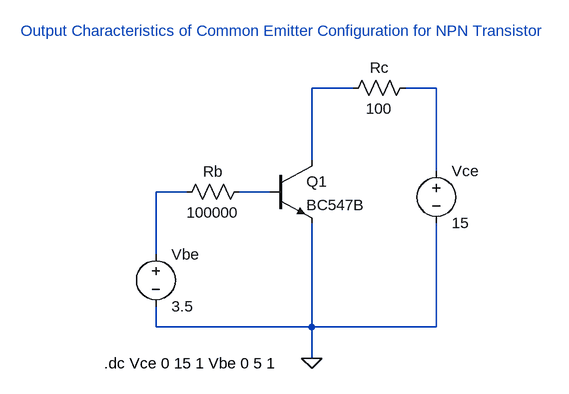
[diagram p0: schematic Assignment 5a (ii).asc]
Assignment 5a (ii).asc, the LTspice schematic file:
Version 4
SHEET 1 880 680
WIRE 336 -32 272 -32
WIRE 464 -32 416 -32
WIRE 272 80 272 -32
WIRE 464 96 464 -32
WIRE 80 128 32 128
WIRE 208 128 160 128
WIRE 32 224 32 128
WIRE 32 336 32 304
WIRE 272 336 272 176
WIRE 272 336 32 336
WIRE 464 336 464 176
WIRE 464 336 272 336
WIRE 272 384 272 336
FLAG 272 384 0
SYMBOL voltage 32 208 R0
WINDOW 123 0 0 Left 2
WINDOW 39 0 0 Left 2
SYMATTR InstName Vbe
SYMATTR Value 3.5
SYMBOL voltage 464 80 R0
WINDOW 123 0 0 Left 2
WINDOW 39 0 0 Left 2
SYMATTR InstName Vce
SYMATTR Value 15
SYMBOL res 176 112 R90
WINDOW 0 0 56 VBottom 2
WINDOW 3 32 56 VTop 2
SYMATTR InstName Rb
SYMATTR Value 100000
SYMBOL npn 208 80 R0
SYMATTR InstName Q1
SYMATTR Value BC547B
SYMBOL res 432 -48 R90
WINDOW 0 0 56 VBottom 2
WINDOW 3 32 56 VTop 2
SYMATTR InstName Rc
SYMATTR Value 100
TEXT -176 -120 Left 2 ;Output Characteristics of Common Emitter Configuration for NPN Transistor
TEXT -48 392 Left 2 !.dc Vce 0 15 1 Vbe 0 5 1

The netlist it stands for:
* Assignment 5a (ii).asc
Vbe N003 0 3.5
Vce N002 0 15
Rb N004 N003 100000
Q1 N001 N004 0 0 BC547B
Rc N002 N001 100
.model NPN NPN
.model PNP PNP
.lib standard.bjt
* Output Characteristics of Common Emitter Configuration for NPN Transistor
.dc Vce 0 15 1 Vbe 0 5 1
.backanno
.end